# EAGLE design DA_uno_shield_3_0 (EAGLE 7.7.0)
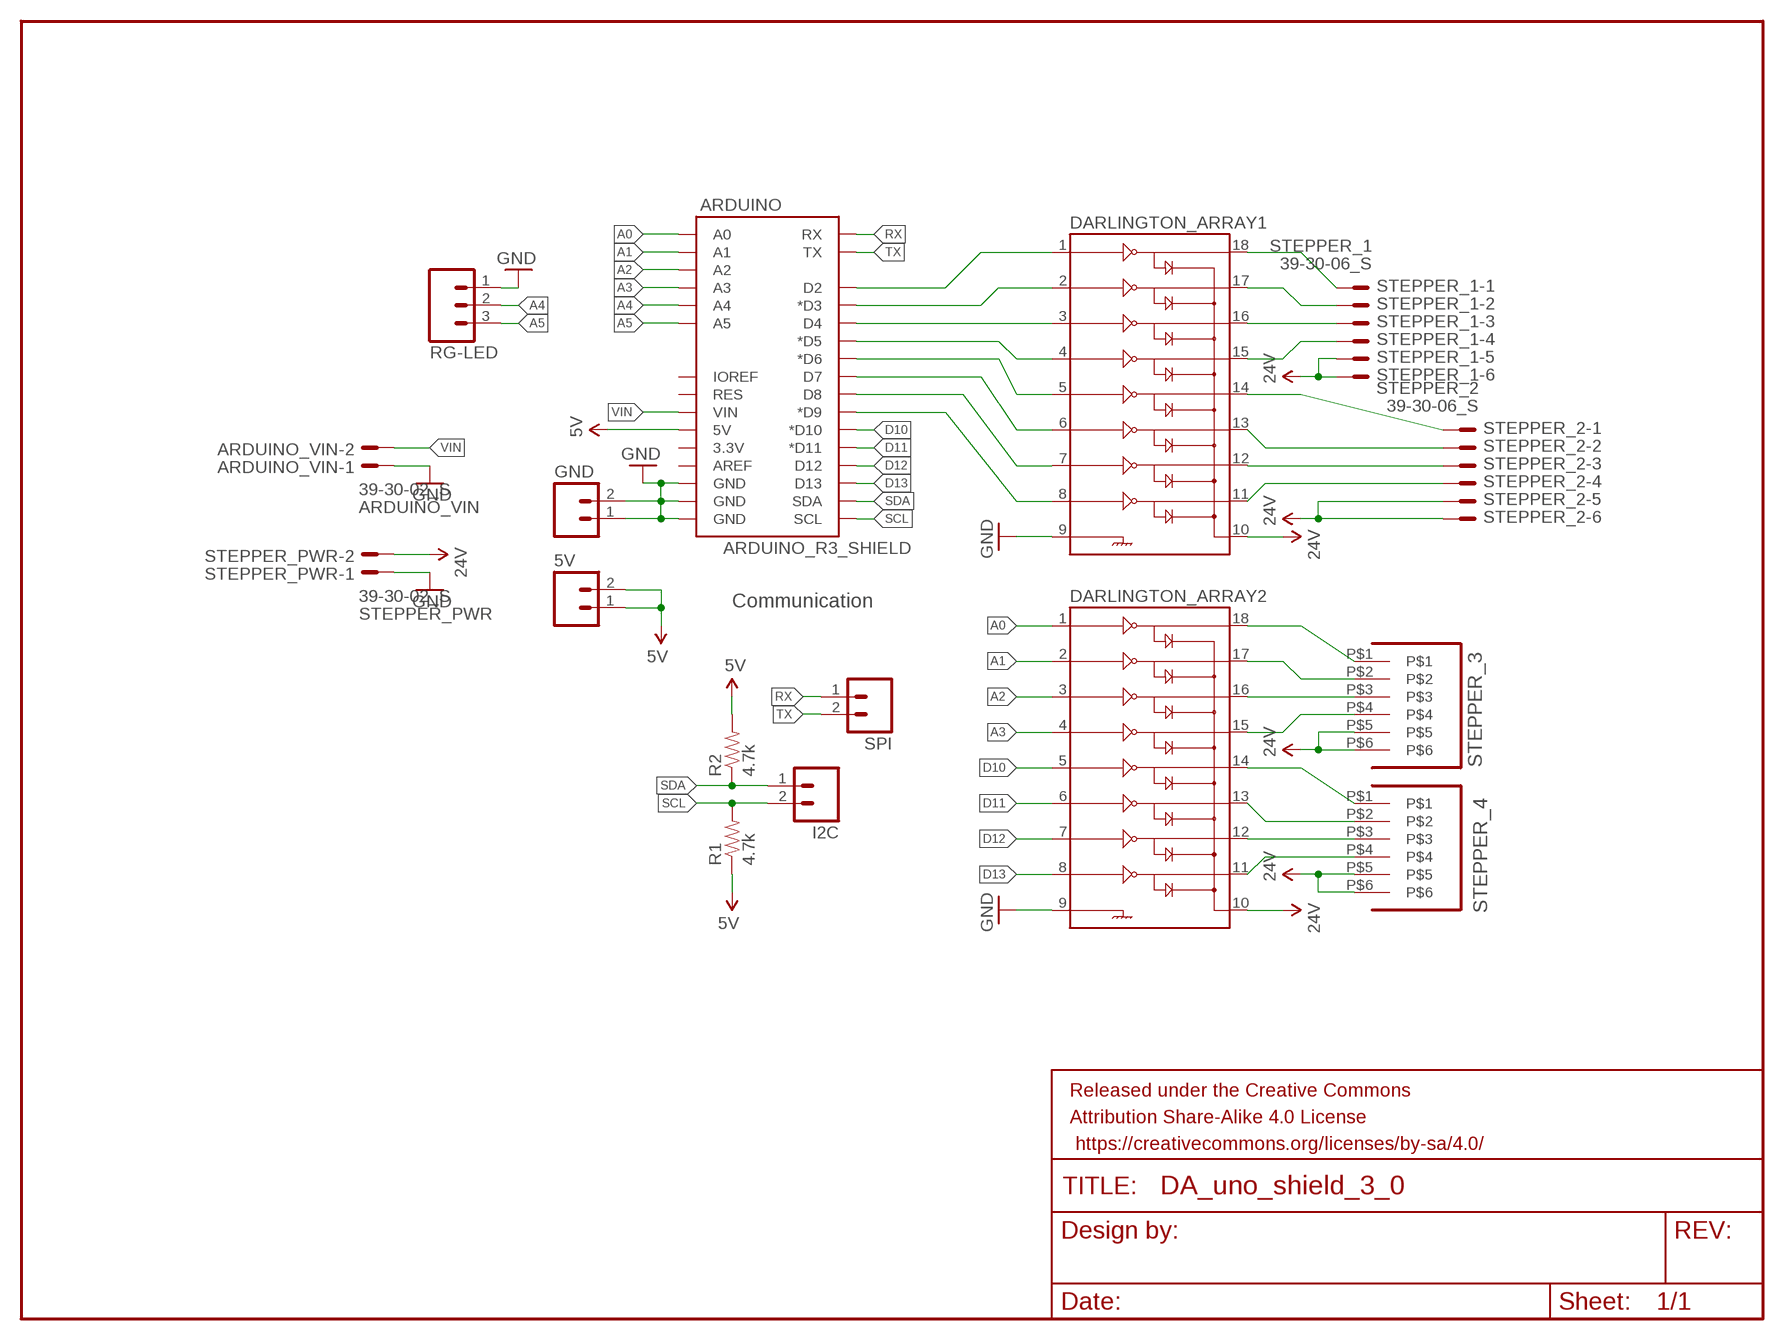
[diagram p0: schematic, sheet 1]

## Parts
5V  M021X02_NO_SILK  [1X02_NO_SILK]
ARDUINO  ARDUINO_R3_SHIELD  [UNO_R3_SHIELD]
ARDUINO_VIN  39-30-02_S  [39-30-?02?]
DARLINGTON_ARRAY1  ULN2803DIP  [DIL18]
DARLINGTON_ARRAY2  ULN2803DIP  [DIL18]
FRAME1  FRAME-LETTER  [CREATIVE_COMMONS]
GND  M021X02_NO_SILK  [1X02_NO_SILK]
I2C  M021X02_NO_SILK  [1X02_NO_SILK]
R1  4.7k  RESISTORKIT  [AXIAL-0.3-KIT]
R2  4.7k  RESISTORKIT  [AXIAL-0.3-KIT]
RG-LED  M03LOCK_NO_SILK  [1X03_LOCK_NO_SILK]
SPI  M021X02_NO_SILK  [1X02_NO_SILK]
STEPPER_1  39-30-06_S  [39-30-?06?]
STEPPER_2  39-30-06_S  [39-30-?06?]
STEPPER_3  39-29-06  [39-29-?06?]
STEPPER_4  39-29-06  [39-29-?06?]
STEPPER_PWR  39-30-02_S  [39-30-?02?]

## Nets
5V: 5V.1 5V.2 ARDUINO.5V R1.P$1 R2.P$2
A0: ARDUINO.A0 DARLINGTON_ARRAY2.1
A1: ARDUINO.A1 DARLINGTON_ARRAY2.2
A2: ARDUINO.A2 DARLINGTON_ARRAY2.3
A3: ARDUINO.A3 DARLINGTON_ARRAY2.4
A4: ARDUINO.A4 RG-LED.2
A5: ARDUINO.A5 RG-LED.3
D10: ARDUINO.D10(*D10) DARLINGTON_ARRAY2.5
D11: ARDUINO.D11(*D11) DARLINGTON_ARRAY2.6
D12: ARDUINO.D12 DARLINGTON_ARRAY2.7
D13: ARDUINO.D13 DARLINGTON_ARRAY2.8
GND: ARDUINO.GND@0(GND) ARDUINO.GND@1(GND) ARDUINO.GND@2(GND) ARDUINO_VIN.1 DARLINGTON_ARRAY1.9 DARLINGTON_ARRAY2.9 GND.1 GND.2 RG-LED.1 STEPPER_PWR.1
N$1: DARLINGTON_ARRAY1.14 STEPPER_2.1
N$2: DARLINGTON_ARRAY1.13 STEPPER_2.2
N$3: DARLINGTON_ARRAY1.12 STEPPER_2.3
N$4: DARLINGTON_ARRAY1.11 STEPPER_2.4
N$5: ARDUINO.D6(*D6) DARLINGTON_ARRAY1.5
N$6: ARDUINO.D7 DARLINGTON_ARRAY1.6
N$7: ARDUINO.D8 DARLINGTON_ARRAY1.7
N$8: ARDUINO.D9(*D9) DARLINGTON_ARRAY1.8
N$30: DARLINGTON_ARRAY2.18 STEPPER_3.P$1
N$33: ARDUINO.D2 DARLINGTON_ARRAY1.1
N$34: DARLINGTON_ARRAY1.18 STEPPER_1.1
N$35: DARLINGTON_ARRAY1.17 STEPPER_1.2
N$36: DARLINGTON_ARRAY1.16 STEPPER_1.3
N$37: DARLINGTON_ARRAY1.15 STEPPER_1.4
N$38: ARDUINO.D3(*D3) DARLINGTON_ARRAY1.2
N$39: ARDUINO.D4 DARLINGTON_ARRAY1.3
N$40: ARDUINO.D5(*D5) DARLINGTON_ARRAY1.4
N$41: DARLINGTON_ARRAY2.17 STEPPER_3.P$2
N$42: DARLINGTON_ARRAY2.16 STEPPER_3.P$3
N$43: DARLINGTON_ARRAY2.15 STEPPER_3.P$4
N$44: DARLINGTON_ARRAY2.14 STEPPER_4.P$1
N$45: DARLINGTON_ARRAY2.13 STEPPER_4.P$2
N$46: DARLINGTON_ARRAY2.12 STEPPER_4.P$3
N$47: DARLINGTON_ARRAY2.11 STEPPER_4.P$4
RX: ARDUINO.RX SPI.1
SCL: ARDUINO.SCL I2C.2 R1.P$2
SDA: ARDUINO.SDA I2C.1 R2.P$1
TX: ARDUINO.TX SPI.2
VCC: DARLINGTON_ARRAY1.10 DARLINGTON_ARRAY2.10 STEPPER_1.5 STEPPER_1.6 STEPPER_2.5 STEPPER_2.6 STEPPER_3.P$5 STEPPER_3.P$6 STEPPER_4.P$5 STEPPER_4.P$6 STEPPER_PWR.2 ; supply symbol labelled 24V
VIN: ARDUINO.VIN ARDUINO_VIN.2
Unconnected: ARDUINO.3.3V ARDUINO.AREF ARDUINO.IOREF ARDUINO.RES

## Notes on the sheet
- Communication

## Library data of the parts
5V GND I2C SPI = SparkFun-Connectors:M02: Standard 2-pin 0.1" header. Use with - straight break away headers ( PRT-00116) - right angle break away headers (PRT-00553) - swiss pins (PRT-00743) - machine pins (PRT-00117) - female headers (PRT-00115) Molex polarized connector foot print use with: PRT-08233 with associated crimp pins and housings. 2.54_SCREWTERM for use with PRT-10571. 3.5mm Screw Terminal footprints for PRT-08084 5mm Screw Terminal footprints for use with PRT-08432
ARDUINO = Nathans-Arduinos:ARDUINO_R3_SHIELD: Shield form compatible with the Arduino Uno R3.
ARDUINO_VIN STEPPER_PWR = MTIID-molex-mini-fit-with-some-vertical:39-30-?02?_S: HEADER
DARLINGTON_ARRAY1 DARLINGTON_ARRAY2 = SparkFun-PowerIC:ULN2803: Darlington Driver ULN2803 Darlington array. 500mA max per channel, 8-channel package. Spark Fun Electronics SKU : COM-00312
FRAME1 = SparkFun-Aesthetics:FRAME-LETTER: Schematic Frame Standard 8.5x11 US Letter frame
R1 R2 = SparkFun-Resistors:RESISTOR: Resistor Basic schematic elements and footprints for 0603, 1206, and PTH resistors.
RG-LED = SparkFun-Connectors:M03: Header 3 Standard 3-pin 0.1" header. Use with straight break away headers (SKU : PRT-00116), right angle break away headers (PRT-00553), swiss pins (PRT-00743), machine pins (PRT-00117), and female headers (PRT-00115). Molex polarized connector foot print use with SKU : PRT-08232 with associated crimp pins and housings.
STEPPER_1 STEPPER_2 = MTIID-molex-mini-fit-with-some-vertical:39-30-?06?_S: HEADER
STEPPER_3 STEPPER_4 = MTIID-molex-mini-fit-with-some-vertical:39-29-?06?

## Net classes
0 default: width 0.813 mm, drill 0.381 mm, clearance 0.381 mm
1 GND: width 0.508 mm, drill 0.508 mm, clearance 0.406 mm

## Board
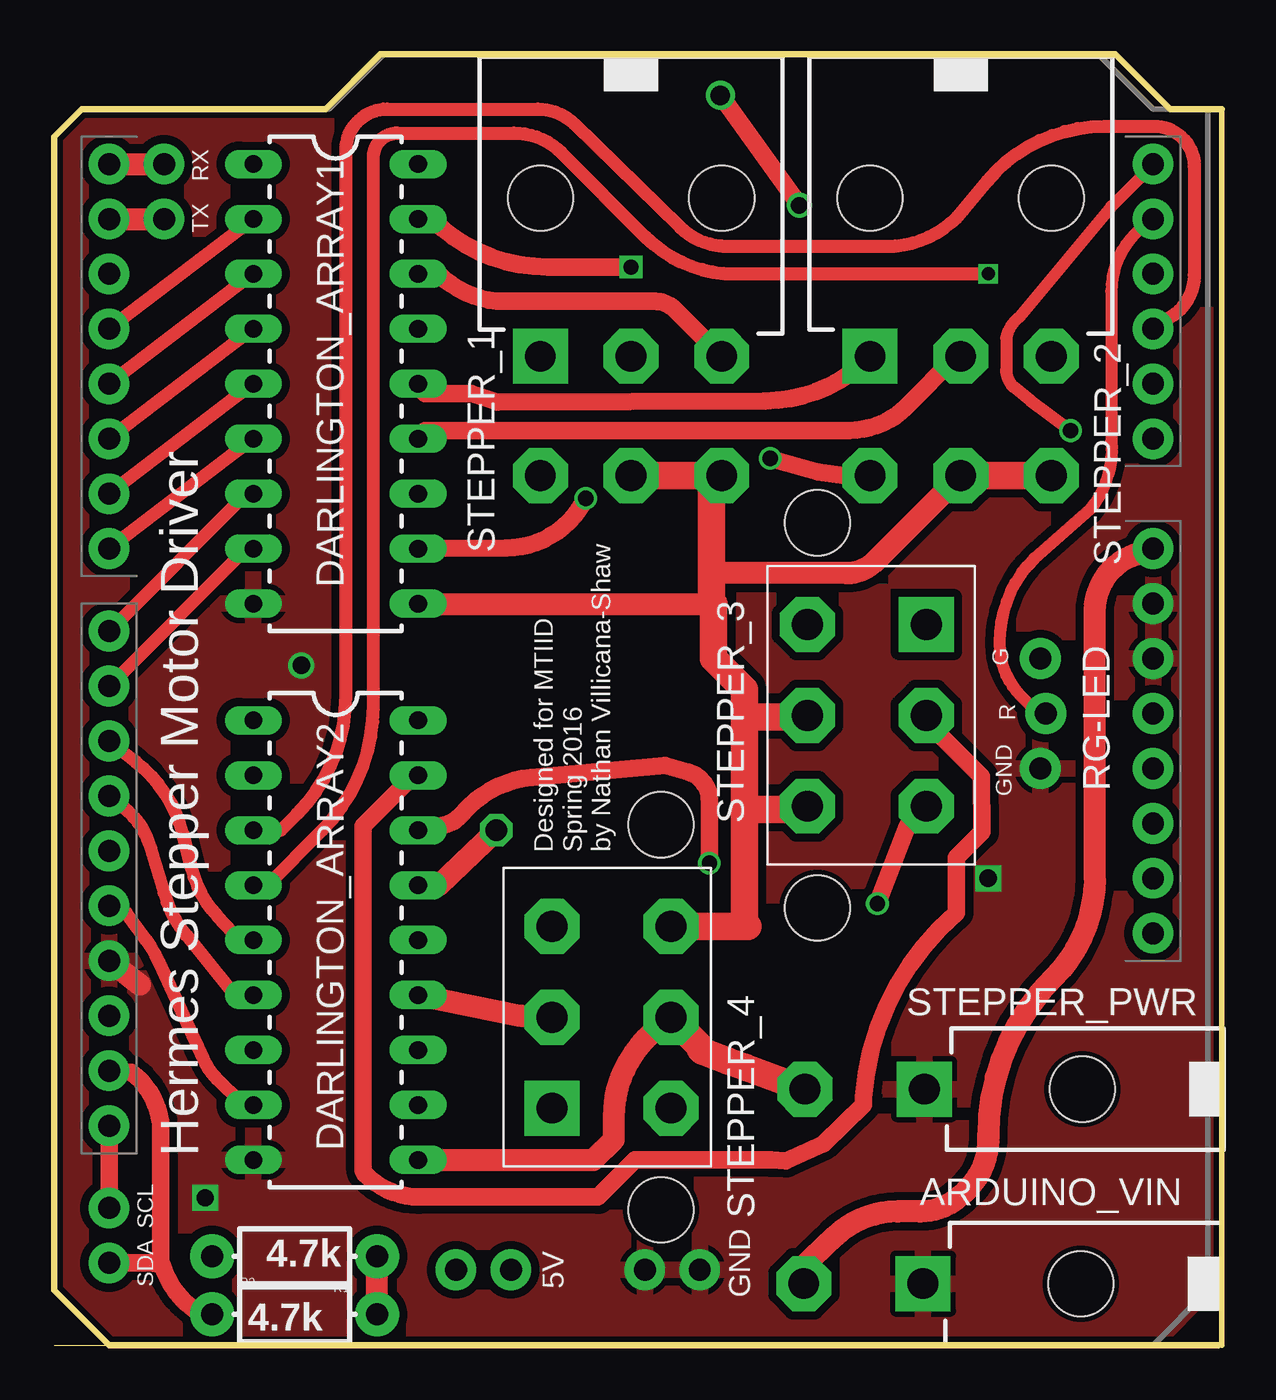
[diagram p1: board, top side]
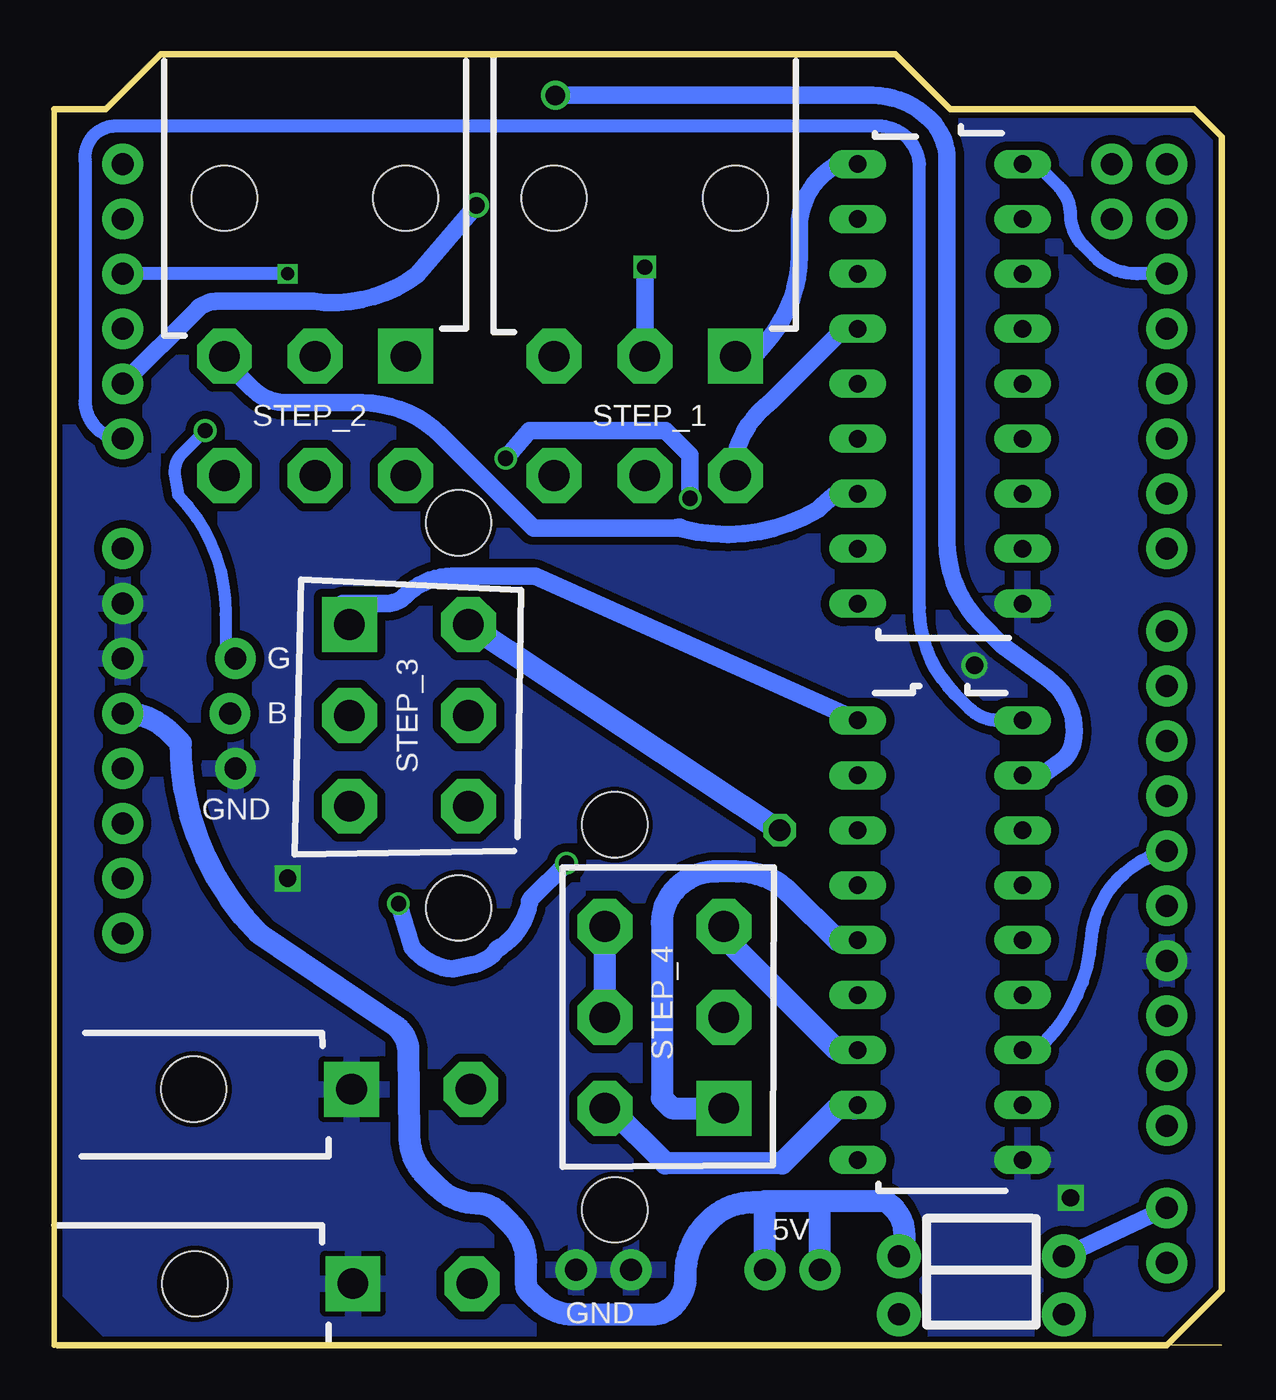
[diagram p2: board, bottom side, seen from below]

Size 53.98 x 59.69 mm. Coordinates in mm from the lower left corner, seen from the top.
Outline: 0,0 2.54,0
Outline: 2.54,0 51.74,0
Outline: 53.98,0 53.98,57.15 51.59,57.15 49.05,59.69 15.08,59.69 12.54,57.15 1.27,57.15 0,55.88 0,2.54 2.54,0
Outline: 2.54,0 53.82,0
Copper layers (1*16): Top 0.035mm / dielectric 1.5mm / Bottom 0.035mm
Design rules "SeeedStudio_2layer_DRU_no_angle_20140221": minimum track width 6mil, minimum drill 12mil, track to track 6mil, track to pad 6mil, pad to pad 6mil, via to via 6mil, smd to smd 0mil, copper to edge 10mil, drill to drill 10mil, minimum pad ring 10mil, minimum via ring 6mil, stop-mask expansion 2mil, vias tented up to drill 100mil, thermal gap 10mil

### Footprints (pad centres in the part's own frame; a part is rotated, then mirrored left to right if it is on the bottom)
1X02_NO_SILK = drill 1.016 pad 1.88: 1 0,0; 2 2.54,0
UNO_R3_SHIELD = drill 1.016 pad 1.88: 3.3V 50.8,26.67; 5V 50.8,29.21; A0 50.8,41.91; A1 50.8,44.45; A2 50.8,46.99; A3 50.8,49.53; A4 50.8,52.07; A5 50.8,54.61; AREF 2.54,15.24; D2 2.54,49.53; D3 2.54,46.99; D4 2.54,44.45; D5 2.54,41.91; D6 2.54,39.37; D7 2.54,36.83; D8 2.54,33.02; D9 2.54,30.48; D10 2.54,27.94; D11 2.54,25.4; D12 2.54,22.86; D13 2.54,20.32; GND@0 50.8,31.75; GND@1 50.8,34.29; GND@2 2.54,17.78; IOREF 50.8,21.59; NC 50.8,19.05; RES 50.8,24.13; RX 2.54,54.61; SCL 2.54,10.16; SDA 2.54,12.7; TX 2.54,52.07; VIN 50.8,36.83
39-30-?02? = drill 1.422 pad 2.54 square: 1 0,0 | drill 1.422 pad 2.54 octagon: 2 0,5.512 | hole 3: 0,-7.3
DIL18 = drill 0.813 long: 1 -10.16,-3.81; 2 -7.62,-3.81; 3 -5.08,-3.81; 4 -2.54,-3.81; 5 0,-3.81; 6 2.54,-3.81; 7 5.08,-3.81; 8 7.62,-3.81; 9 10.16,-3.81; 10 10.16,3.81; 11 7.62,3.81; 12 5.08,3.81; 13 2.54,3.81; 14 0,3.81; 15 -2.54,3.81; 16 -5.08,3.81; 17 -7.62,3.81; 18 -10.16,3.81
AXIAL-0.3-KIT = drill 1.016 pad 2.032: P$1 -3.81,0; P$2 3.81,0
1X03_LOCK_NO_SILK = drill 1.016 pad 1.88: 1 0,0.127; 2 2.54,-0.127; 3 5.08,0.127
39-30-?06? = drill 1.422 pad 2.54 square: 1 4.191,0 | drill 1.422 pad 2.54 octagon: 2 0,0; 3 -4.191,0; 4 4.191,5.512; 5 0,5.512; 6 -4.191,5.512 | hole 3: -4.191,-7.3; 4.191,-7.3
39-29-?06? = drill 1.422 pad 2.54 square: P$1 8.4,0 | drill 1.422 pad 2.54 octagon: P$2 4.2,0; P$3 0,0; P$4 8.4,5.5; P$5 4.2,5.5; P$6 0,5.5 | hole 3: -4.7,5.04; 13.1,5.04

### Placement (x,y rotation side)
5V  18.57,3.49 0 top
ARDUINO  0,0 0 top
ARDUINO_VIN  39-30-02?_S  [39-30-?02?]  40.16,2.86 90 top
DARLINGTON_ARRAY1  13.02,44.45 270 top
DARLINGTON_ARRAY2  13.02,18.73 270 top
FRAME1  15.24,-17.78 0 top  (outside the outline)
GND  27.3,3.49 0 top
I2C  2.54,3.81 90 top
R1  11.11,4.13 180 top
R2  11.11,1.43 0 top
RG-LED  45.72,26.67 90 top
SPI  5.08,54.61 270 top
STEPPER_1  39-30-06?_S  [39-30-?06?]  26.67,45.72 180 top
STEPPER_2  39-30-06?_S  [39-30-?06?]  41.91,45.72 180 top
STEPPER_3  39-29-06?  [39-29-?06?]  40.32,24.92 90 top
STEPPER_4  39-29-06?  [39-29-?06?]  23.02,19.37 270 top
STEPPER_PWR  39-30-02?_S  [39-30-?02?]  40.22,11.85 90 top

### Tracks (layer width: path | path; a pad name or v marks a point on that pad's centre or on a via)
5V
  Top 1.016: R2.P$2 R1.P$1
  Bottom 1.016: R1.P$1 arc-90 15.56,6.67 18.57,6.67 | 18.57,6.67 21.11,6.67 | 5V.1 18.57,6.67 | 5V.2 21.11,6.67 | 21.11,6.67 21.18,6.6 21.71,6.6 arc-45 23.69,5.79 23.82,5.65 arc-45 24.79,3.31 24.79,3.14 arc45 25.33,1.84 arc45 26.35,1.42 29.93,1.42 arc45 31.65,2.13 32.03,2.51 arc45 32.15,2.8 32.15,3.9 arc-45 32.85,5.59 33.41,6.15 arc-45 34.41,6.56 arc45 36.26,7.33 36.81,7.87 arc45 37.55,9.65 37.59,13.66 arc-45 38.08,14.67 44.47,19 arc45 48.12,27.82 48.12,27.84 48.66,28.37 arc-45 50.68,29.21 ARDUINO.5V
A0
  Bottom 0.61: DARLINGTON_ARRAY2.1 10.35,28.89 arc45 11.65,29.43 12.31,30.09 arc45 13.97,34.1 13.97,54.61 arc-90 16.03,56.36 51.26,56.36 arc-90 52.55,54.76 52.55,43.66 arc-90 ARDUINO.A0
A1  (via drill 0.76 pad 1.02, 0.9 pad 1.02)
  Top 0.813: v34.45,52.7 v30.8,57.78
  Bottom 0.813: DARLINGTON_ARRAY2.2 8.1,26.51 7.43,26.98 arc-43 6.88,27.85 arc-65 8.02,30.8 10.16,32.38 11.11,33.34 arc45 12.7,37.17 12.7,54.83 arc-45 13.44,56.62 13.52,56.7 arc-45 16.14,57.78 v30.8,57.78 | ARDUINO.A1 47.36,47.89 arc45 46.46,48.26 42,48.26 arc-45 37.19,49.48 v34.45,52.7
A2
  Top 0.61: DARLINGTON_ARRAY2.3 10.48,23.81 11.23,24.57 arc45 13.49,30.02 13.49,55.24 arc-90 15.4,57.15 22.35,57.15 arc-44 24.04,56.46 28.92,51.7 arc44 31.14,50.8 38.49,50.8 arc50 42.01,52.46 43.14,53.82 arc-50 48.54,56.36 50.85,56.36 arc-90 52.7,54.5 52.7,49.48 arc-56 51.69,47.58 ARDUINO.A2
A3  (via drill 0.6)
  Top 0.61: DARLINGTON_ARRAY2.4 9.84,21.27 12.4,23.83 arc45 14.76,29.54 14.76,54.93 arc-90 15.88,56.04 21.25,56.04 arc-45 23.46,55.12 27.35,51.23 arc45 31.46,49.53 v43.18,49.53
  Bottom 0.61: v43.18,49.53 ARDUINO.A3
A4
  Top 0.559: RG-LED.2 45.58,29.6 45.11,29.6 44.69,30.03 arc-45 43.7,32.41 43.7,32.51 arc-45 45.3,36.38 47.88,38.63 arc45 48.87,41.8 48.87,48.71 arc-45 49.98,51.39 50.75,52.16 ARDUINO.A4
A5  (via drill 0.7)
  Top 0.559: v46.99,42.29 45.1,43.7 45.11,43.7 44.34,44.31 arc-45 44.01,45.1 44.01,46.58 arc-40 44.63,47.55 48.87,52.64 48.87,52.63 50.75,54.51 ARDUINO.A5
  Bottom 0.559: v46.99,42.29 48.07,41.21 arc-54 48.39,40.23 48.24,39.31 arc45 46.05,33.8 46.05,31.95 RG-LED.3
D10
  Top 0.61: ARDUINO.D10 3.75,27 arc-38 5.92,23.7 6.34,22.06 arc28 7.55,19.84 8.57,18.73 DARLINGTON_ARRAY2.5
D11
  Top 0.61: ARDUINO.D11 3.19,24.88 arc-35 4.47,22.98 5.08,20.92 arc22 6.1,18.97 8.1,16.51 DARLINGTON_ARRAY2.6
D12
  Bottom 0.61: DARLINGTON_ARRAY2.7 9.05,13.81 8.41,13.81 8.19,14.04 arc-41 6.03,18.73 arc72 ARDUINO.D12 2.64,22.86
D13
  Top 0.61: ARDUINO.D13 3.33,20 4.23,18.77 arc-11 4.87,17.68 6.9,13.24 arc20 7.56,12.28 8.57,11.27 DARLINGTON_ARRAY2.8
GND  (via drill 0.8)
  Top 1.016: ARDUINO.GND@2 3.97,16.67
  other vias: 11.43,31.43 43.18,21.59 6.99,6.83
  pour Bottom: 15.24,59.69 12.7,57.15 1.27,57.15 0,55.88 0,2.54 2.54,0 50.8,0 53.34,2.54 53.34,57.15 50.8,57.15 48.26,59.69
  pour Top: 1.27,57.15 0,55.88 0,2.54 2.54,0 50.8,0 53.34,2.54 53.34,57.15 50.8,57.15 48.26,59.69 15.24,59.69 12.7,57.15
N$1
  Top 0.813: STEPPER_2.1 arc-45 32.85,43.66 20.51,43.59 19.3,44.01 17.14,44.01 DARLINGTON_ARRAY1.14
N$2
  Top 0.813: DARLINGTON_ARRAY1.13 17.14,42.29 36.75,42.29 arc45 39.38,43.38 41.72,45.72 STEPPER_2.2
N$3
  Bottom 0.813: DARLINGTON_ARRAY1.12 17.95,39.27 18.5,38.8 18.67,38.63 arc45 24.97,37.76 24.99,37.8 arc-45 25.23,37.78 31.81,37.78 36.09,42.05 arc-45 39.75,43.57 43.19,43.57 arc45 44.86,44.27 45.96,45.36 STEPPER_2.3
N$4  (via drill 0.7)
  Top 0.813: v24.57,39.16 24.46,38.96 arc-60 20.89,36.85 17.34,36.83 DARLINGTON_ARRAY1.11 | v33.1,41 35.34,40.37 36.5,40.2 STEPPER_2.4
  Bottom 0.813: v24.57,39.16 24.57,41.15 25.72,42.29 32,42.29 v33.1,41
N$5
  Top 0.61: ARDUINO.D6 DARLINGTON_ARRAY1.5
N$6
  Top 0.61: ARDUINO.D7 DARLINGTON_ARRAY1.6
N$7
  Top 0.61: ARDUINO.D8 8.89,39.37 DARLINGTON_ARRAY1.7
N$8
  Top 0.61: ARDUINO.D9 8.89,36.83 DARLINGTON_ARRAY1.8
N$30
  Bottom 0.813: DARLINGTON_ARRAY2.18 31.75,35.56 35.56,35.56 arc-45 37.73,34.66 arc45 38.63,34.29 40.64,34.29 40.32,33.97 STEPPER_3.P$1
N$33
  Bottom 0.61: ARDUINO.D2 3.9,49.53 arc45 5.91,50.36 6.4,50.85 arc45 6.99,52.27 arc-45 7.52,53.56 8.57,54.61 DARLINGTON_ARRAY1.1
N$34
  Bottom 0.813: DARLINGTON_ARRAY1.18 17.78,54.61 18.18,54.32 arc-54 19.53,51.67 19.53,50.39 arc39 20.87,46.6 21.59,45.72 STEPPER_1.1
N$35  (via drill 0.7)
  Top 0.813: DARLINGTON_ARRAY1.17 17.46,52.07 arc45 22.83,49.85 v26.67,49.85
  Bottom 0.813: v26.67,49.85 STEPPER_1.2
N$36
  Top 0.813: DARLINGTON_ARRAY1.16 17.78,49.53 arc45 20.85,48.26 27.77,48.26 arc-45 28.71,47.87 STEPPER_1.3
N$37
  Bottom 0.813: DARLINGTON_ARRAY1.15 17.47,47.03 17.91,46.56 20.82,43.65 arc-45 22.56,40.75 STEPPER_1.4
N$38
  Top 0.61: ARDUINO.D3 DARLINGTON_ARRAY1.2
N$39
  Top 0.61: ARDUINO.D4 DARLINGTON_ARRAY1.3
N$40
  Top 0.61: ARDUINO.D5 DARLINGTON_ARRAY1.4
N$41
  Top 0.813: DARLINGTON_ARRAY2.17 16.57,26.29 14.29,24 14.29,8.18 arc45 14.41,7.88 arc45 16.87,6.86 25.15,6.86 26.86,8.57 33.15,8.57 33.84,8.54 35.55,9.33 37.42,11.13 37.42,11.49 arc-45 41.72,20 41.72,22.56 42.89,23.73 42.86,26.29 40.58,28.57 STEPPER_3.P$2
N$42  (via drill 0.7)
  Top 0.813: v30.29,22.29 30.29,25.2 arc74 29.31,26.51 28.24,26.82 22.07,26.25 arc40 19.19,24.91 18.72,24.44 arc-45 17.67,24 17.14,24 DARLINGTON_ARRAY2.16 | v38.06,20.42 39.43,24 40.01,24.57 STEPPER_3.P$3
  Bottom 0.813: v30.29,22.29 31.92,20.66 arc-45 32,20.45 arc45 33.3,18.43 33.51,18.29 arc45 34.68,17.59 35.54,17.39 arc45 37.43,18.4 v38.06,20.42
N$43  (via drill 1)
  Top 1.016: DARLINGTON_ARRAY2.15 17.78,21.27 v20.43,23.81
  Bottom 1.016: v20.43,23.81 STEPPER_3.P$4
N$44
  Top 0.559: DARLINGTON_ARRAY2.14 16.92,18.8 16.99,18.89
  Bottom 1.016: DARLINGTON_ARRAY2.14 16.99,18.89 17.62,18.89 17.78,18.73 19.95,20.9 arc-45 22.38,21.91 23.36,21.91 arc-45 25.21,21.14 arc-45 25.88,19.54 25.88,11.43 25.41,10.97 STEPPER_4.P$1
N$45
  Top 1.016: DARLINGTON_ARRAY2.13 21.59,15.24 STEPPER_4.P$2
N$46
  Bottom 1.016: DARLINGTON_ARRAY2.12 17.78,13.65 23.02,18.89 STEPPER_4.P$3
N$47
  Bottom 1.016: DARLINGTON_ARRAY2.11 16.99,10.95 17.78,10.95 20.32,8.41 25.72,8.41 28.27,10.97 STEPPER_4.P$4
RX
  Top 1.016: ARDUINO.RX SPI.1
SCL
  Top 0.813: ARDUINO.SCL I2C.2
  Bottom 0.813: I2C.2 R1.P$2
SDA
  Top 0.813: ARDUINO.SDA 3.57,12.63 arc-45 4.92,10.32 4.92,3.81 4.45,3.81 | 4.45,3.81 5,3.73 arc45 6.86,1.43 R2.P$1 | I2C.1 4.45,3.81
TX
  Top 1.016: ARDUINO.TX SPI.2
VCC
  Top 1.016: DARLINGTON_ARRAY2.10 24.92,8.57 25.88,9.53 25.88,10.52 arc-45 27.42,14.24 28.34,15.17 STEPPER_4.P$5 | 16.84,34.27 30.39,34.27 | STEPPER_2.5 37.94,36.23 arc-45 36.63,35.69 30.39,35.69
  Top 1.27: STEPPER_1.6 STEPPER_1.5 | STEPPER_2.6 STEPPER_2.5 | STEPPER_PWR.2 31.95,12.86 31.12,13.16 29.99,13.6 arc-69 29.84,13.81 28.52,15.14 STEPPER_4.P$5 | STEPPER_4.P$6 32.07,19.37 31.91,19.53 31.91,24.77 | 31.91,24.77 31.91,29.05 | 31.91,29.05 31.91,30.32 30.48,31.75 30.48,34.24 30.51,34.27 30.39,34.27 30.39,35.69 30.39,39.53 31.07,40.21 | STEPPER_3.P$6 34.66,24.77 31.91,24.77 | STEPPER_3.P$5 34.81,29.13 33.98,29.13 33.9,29.05 31.91,29.05 | DARLINGTON_ARRAY1.10 16.84,34.27
  Top 1.422: STEPPER_1.6 31.07,40.21
  Bottom 1.016: STEPPER_4.P$5 STEPPER_4.P$6
VIN
  Top 1.016: ARDUINO.VIN 49.93,36.54 arc27 48.95,35.94 48.92,35.91 arc45 48.1,33.92 48.1,21.61 arc-45 46.18,16.97 arc45 43.18,9.73 43.18,9.53 arc-47 42.13,7.12 41.9,6.92 arc-43 40.05,6.19 38.98,6.19 arc44 36.09,5.03 33.97,3.02 ARDUINO_VIN.2

### Text on the board
tNames: RX | TX | G | R | GND | Designed for MTIID / Spring 2016 / by Nathan Villicana-Shaw | Hermes Stepper Motor Driver | SCL | SDA
bNames: STEP_1 | STEP_2 | G | B | STEP_3 | GND | STEP_4 | 5V | GND